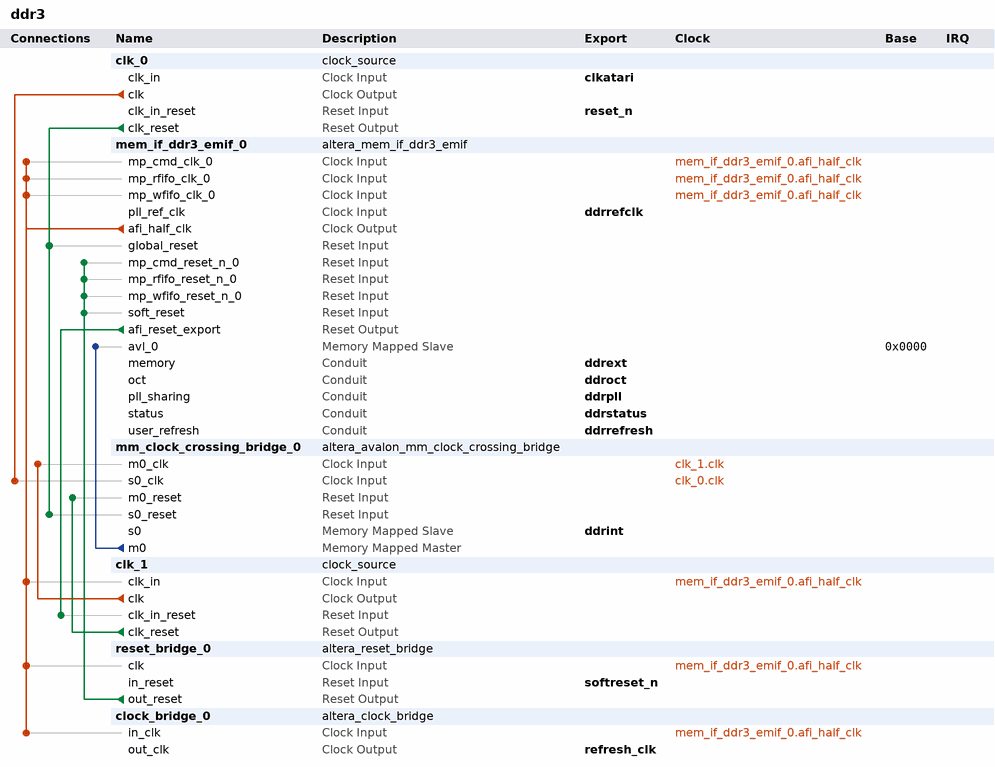
[diagram p0: system contents]
# Platform Designer (Qsys) system ddr3, Cyclone V 5CEFA5F23C8
# Parameters at their usual value, and those the tool derives, are not listed.
package require -exact qsys 23.1
create_system ddr3
set_project_property DEVICE_FAMILY {Cyclone V}
set_project_property DEVICE 5CEFA5F23C8

add_instance clk_0 clock_source 23.1
set_instance_parameter_value clk_0 clockFrequency 50000000

add_instance mem_if_ddr3_emif_0 altera_mem_if_ddr3_emif 23.1
set_instance_parameter_value mem_if_ddr3_emif_0 AVL_MAX_SIZE 4
set_instance_parameter_value mem_if_ddr3_emif_0 CALIBRATION_MODE Skip
set_instance_parameter_value mem_if_ddr3_emif_0 CFG_REORDER_DATA false
set_instance_parameter_value mem_if_ddr3_emif_0 CPORT_TYPE_PORT Bidirectional,Bidirectional,Bidirectional,Bidirectional,Bidirectional,Bidirectional
set_instance_parameter_value mem_if_ddr3_emif_0 CTL_USR_REFRESH_EN true
set_instance_parameter_value mem_if_ddr3_emif_0 EXPORT_AFI_HALF_CLK true
set_instance_parameter_value mem_if_ddr3_emif_0 HARD_EMIF true
set_instance_parameter_value mem_if_ddr3_emif_0 MEM_BANKADDR_WIDTH 3
set_instance_parameter_value mem_if_ddr3_emif_0 MEM_CLK_FREQ 333.0
set_instance_parameter_value mem_if_ddr3_emif_0 MEM_CLK_FREQ_MAX 800.0
set_instance_parameter_value mem_if_ddr3_emif_0 MEM_COL_ADDR_WIDTH 10
set_instance_parameter_value mem_if_ddr3_emif_0 MEM_DQ_WIDTH 16
set_instance_parameter_value mem_if_ddr3_emif_0 MEM_DRV_STR RZQ/6
set_instance_parameter_value mem_if_ddr3_emif_0 MEM_FORMAT DISCRETE
set_instance_parameter_value mem_if_ddr3_emif_0 MEM_ROW_ADDR_WIDTH 15
set_instance_parameter_value mem_if_ddr3_emif_0 MEM_TCL 7
set_instance_parameter_value mem_if_ddr3_emif_0 MEM_TFAW_NS 45.0
set_instance_parameter_value mem_if_ddr3_emif_0 MEM_TRAS_NS 35.0
set_instance_parameter_value mem_if_ddr3_emif_0 MEM_TRCD_NS 13.75
set_instance_parameter_value mem_if_ddr3_emif_0 MEM_TRFC_NS 260.0
set_instance_parameter_value mem_if_ddr3_emif_0 MEM_TRP_NS 13.75
set_instance_parameter_value mem_if_ddr3_emif_0 MEM_TRRD_NS 7.5
set_instance_parameter_value mem_if_ddr3_emif_0 MEM_TRTP_NS 7.5
set_instance_parameter_value mem_if_ddr3_emif_0 MEM_TWTR 6
set_instance_parameter_value mem_if_ddr3_emif_0 MEM_VENDOR Micron
set_instance_parameter_value mem_if_ddr3_emif_0 MEM_WTCL 6
set_instance_parameter_value mem_if_ddr3_emif_0 PLL_LOCATION Top_Bottom
set_instance_parameter_value mem_if_ddr3_emif_0 POWER_OF_TWO_BUS false
set_instance_parameter_value mem_if_ddr3_emif_0 PRIORITY_PORT 1,1,1,1,1,1
set_instance_parameter_value mem_if_ddr3_emif_0 RATE Full
set_instance_parameter_value mem_if_ddr3_emif_0 REF_CLK_FREQ 50.0
set_instance_parameter_value mem_if_ddr3_emif_0 SPEED_GRADE 8
set_instance_parameter_value mem_if_ddr3_emif_0 TIMING_BOARD_AC_SKEW 0.02
set_instance_parameter_value mem_if_ddr3_emif_0 TIMING_BOARD_AC_TO_CK_SKEW 0.0
set_instance_parameter_value mem_if_ddr3_emif_0 TIMING_BOARD_DQ_TO_DQS_SKEW 0.0
set_instance_parameter_value mem_if_ddr3_emif_0 TIMING_BOARD_MAX_CK_DELAY 0.6
set_instance_parameter_value mem_if_ddr3_emif_0 TIMING_BOARD_MAX_DQS_DELAY 0.6
set_instance_parameter_value mem_if_ddr3_emif_0 TIMING_BOARD_SKEW_BETWEEN_DQS 0.02
set_instance_parameter_value mem_if_ddr3_emif_0 TIMING_BOARD_SKEW_CKDQS_DIMM_MAX 0.01
set_instance_parameter_value mem_if_ddr3_emif_0 TIMING_BOARD_SKEW_CKDQS_DIMM_MIN -0.01
set_instance_parameter_value mem_if_ddr3_emif_0 TIMING_BOARD_SKEW_WITHIN_DQS 0.02
set_instance_parameter_value mem_if_ddr3_emif_0 TIMING_TDH 55
set_instance_parameter_value mem_if_ddr3_emif_0 TIMING_TDQSCK 225
set_instance_parameter_value mem_if_ddr3_emif_0 TIMING_TDQSQ 125
set_instance_parameter_value mem_if_ddr3_emif_0 TIMING_TDQSS 0.25
set_instance_parameter_value mem_if_ddr3_emif_0 TIMING_TDS 55
set_instance_parameter_value mem_if_ddr3_emif_0 TIMING_TDSH 0.2
set_instance_parameter_value mem_if_ddr3_emif_0 TIMING_TDSS 0.2
set_instance_parameter_value mem_if_ddr3_emif_0 TIMING_TIH 130
set_instance_parameter_value mem_if_ddr3_emif_0 TIMING_TIS 185
set_instance_parameter_value mem_if_ddr3_emif_0 TIMING_TQSH 0.4
set_instance_parameter_value mem_if_ddr3_emif_0 USER_DEBUG_LEVEL 0

add_instance mm_clock_crossing_bridge_0 altera_avalon_mm_clock_crossing_bridge 23.1
set_instance_parameter_value mm_clock_crossing_bridge_0 ADDRESS_UNITS WORDS
set_instance_parameter_value mm_clock_crossing_bridge_0 ADDRESS_WIDTH 10
set_instance_parameter_value mm_clock_crossing_bridge_0 COMMAND_FIFO_DEPTH 4
set_instance_parameter_value mm_clock_crossing_bridge_0 DATA_WIDTH 32
set_instance_parameter_value mm_clock_crossing_bridge_0 MASTER_SYNC_DEPTH 2
set_instance_parameter_value mm_clock_crossing_bridge_0 MAX_BURST_SIZE 1
set_instance_parameter_value mm_clock_crossing_bridge_0 RESPONSE_FIFO_DEPTH 4
set_instance_parameter_value mm_clock_crossing_bridge_0 SLAVE_SYNC_DEPTH 2
set_instance_parameter_value mm_clock_crossing_bridge_0 USE_AUTO_ADDRESS_WIDTH 1

add_instance clk_1 clock_source 23.1
set_instance_parameter_value clk_1 clockFrequency 50000000

add_instance reset_bridge_0 altera_reset_bridge 23.1
set_instance_parameter_value reset_bridge_0 ACTIVE_LOW_RESET 1
set_instance_parameter_value reset_bridge_0 SYNCHRONOUS_EDGES deassert

add_instance clock_bridge_0 altera_clock_bridge 23.1
set_instance_parameter_value clock_bridge_0 DERIVED_CLOCK_RATE 166666666
set_instance_parameter_value clock_bridge_0 EXPLICIT_CLOCK_RATE 0

# connections
add_connection clk_0.clk mm_clock_crossing_bridge_0.s0_clk clock
add_connection clk_1.clk mm_clock_crossing_bridge_0.m0_clk clock
add_connection mem_if_ddr3_emif_0.afi_half_clk clk_1.clk_in clock
add_connection mem_if_ddr3_emif_0.afi_half_clk clock_bridge_0.in_clk clock
add_connection mem_if_ddr3_emif_0.afi_half_clk mem_if_ddr3_emif_0.mp_cmd_clk_0 clock
add_connection mem_if_ddr3_emif_0.afi_half_clk mem_if_ddr3_emif_0.mp_rfifo_clk_0 clock
add_connection mem_if_ddr3_emif_0.afi_half_clk mem_if_ddr3_emif_0.mp_wfifo_clk_0 clock
add_connection mem_if_ddr3_emif_0.afi_half_clk reset_bridge_0.clk clock
add_connection clk_0.clk_reset mem_if_ddr3_emif_0.global_reset reset
add_connection clk_0.clk_reset mm_clock_crossing_bridge_0.s0_reset reset
add_connection clk_1.clk_reset mm_clock_crossing_bridge_0.m0_reset reset
add_connection mem_if_ddr3_emif_0.afi_reset_export clk_1.clk_in_reset reset
add_connection reset_bridge_0.out_reset mem_if_ddr3_emif_0.mp_cmd_reset_n_0 reset
add_connection reset_bridge_0.out_reset mem_if_ddr3_emif_0.mp_rfifo_reset_n_0 reset
add_connection reset_bridge_0.out_reset mem_if_ddr3_emif_0.mp_wfifo_reset_n_0 reset
add_connection reset_bridge_0.out_reset mem_if_ddr3_emif_0.soft_reset reset
add_connection mm_clock_crossing_bridge_0.m0 mem_if_ddr3_emif_0.avl_0 avalon
set_connection_parameter_value mm_clock_crossing_bridge_0.m0/mem_if_ddr3_emif_0.avl_0 baseAddress 0x0000

# exported interfaces
add_interface clkatari clock sink
set_interface_property clkatari EXPORT_OF clk_0.clk_in
add_interface ddrext conduit end
set_interface_property ddrext EXPORT_OF mem_if_ddr3_emif_0.memory
add_interface ddrint avalon slave
set_interface_property ddrint EXPORT_OF mm_clock_crossing_bridge_0.s0
add_interface ddroct conduit end
set_interface_property ddroct EXPORT_OF mem_if_ddr3_emif_0.oct
add_interface ddrpll conduit end
set_interface_property ddrpll EXPORT_OF mem_if_ddr3_emif_0.pll_sharing
add_interface ddrrefclk clock sink
set_interface_property ddrrefclk EXPORT_OF mem_if_ddr3_emif_0.pll_ref_clk
add_interface ddrrefresh conduit end
set_interface_property ddrrefresh EXPORT_OF mem_if_ddr3_emif_0.user_refresh
add_interface ddrstatus conduit end
set_interface_property ddrstatus EXPORT_OF mem_if_ddr3_emif_0.status
add_interface refresh_clk clock source
set_interface_property refresh_clk EXPORT_OF clock_bridge_0.out_clk
add_interface reset_n reset sink
set_interface_property reset_n EXPORT_OF clk_0.clk_in_reset
add_interface softreset_n reset sink
set_interface_property softreset_n EXPORT_OF reset_bridge_0.in_reset

set_interconnect_requirement {$system} qsys_mm.clockCrossingAdapter HANDSHAKE
set_interconnect_requirement {$system} qsys_mm.enableEccProtection FALSE
set_interconnect_requirement {$system} qsys_mm.insertDefaultSlave FALSE
set_interconnect_requirement {$system} qsys_mm.maxAdditionalLatency 1

save_system ddr3.qsys
